# EAGLE schematic StarvingStudent (EAGLE 7.5.0)
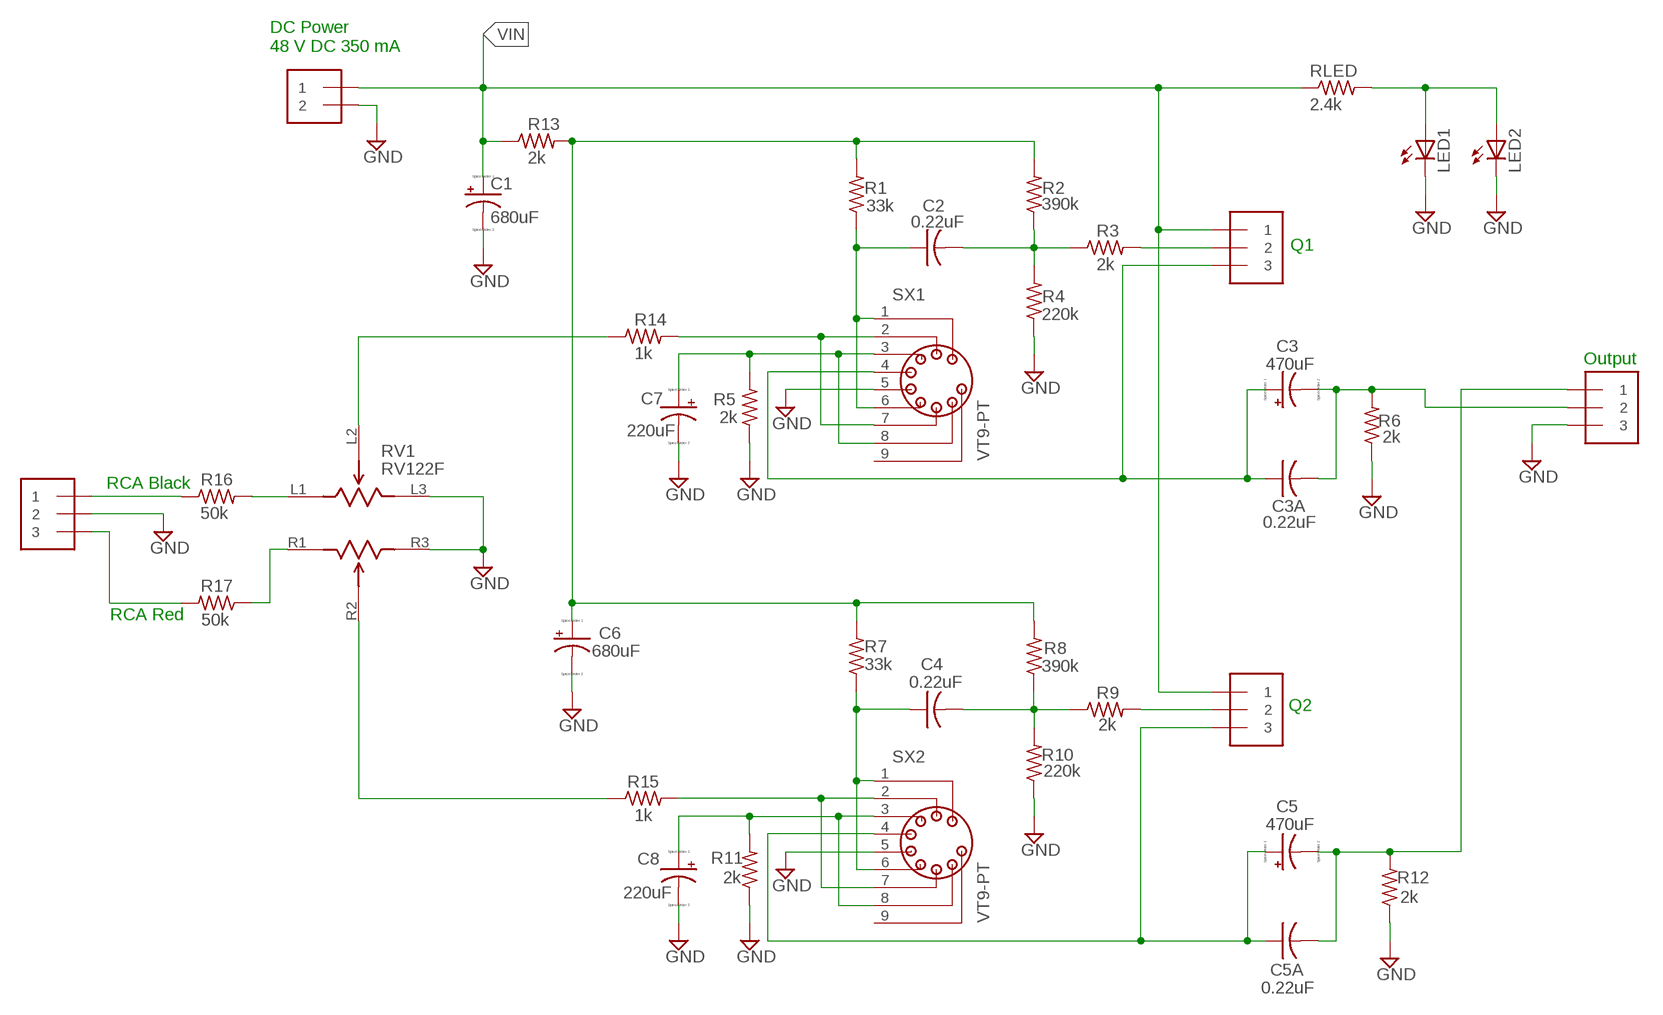
[diagram p0: schematic, sheet 1]

## Parts
C1  680uF  CPOL-USE7.5-18  [E7,5-18]
C2  0.22uF  C-US150-072X183  [C150-072X183]
C3  470uF  CPOL-USE5-13  [E5-13]
C3A  0.22uF  C-US150-072X183  [C150-072X183]
C4  0.22uF  C-US150-072X183  [C150-072X183]
C5  470uF  CPOL-USE5-13  [E5-13]
C5A  0.22uF  C-US150-072X183  [C150-072X183]
C6  680uF  CPOL-USE7.5-18  [E7,5-18]
C7  220uF  CPOL-USE5-13  [E5-13]
C8  220uF  CPOL-USE5-13  [E5-13]
J1  1X2-3.5MM  [1X2-3.5MM]
J2  1X3-3.5MM  [1X3-3.5MM]
J3  1X3-3.5MM  [1X3-3.5MM]
J4  1X3-3.5MM  [1X3-3.5MM]
J5  1X3-3.5MM  [1X3-3.5MM]
LED1  LED3MM  [LED3MM]
LED2  LED3MM  [LED3MM]
R1  33k  R-US_0207/10  [0207/10]
R2  390k  R-US_0207/10  [0207/10]
R3  2k  R-US_0207/10  [0207/10]
R4  220k  R-US_0207/10  [0207/10]
R5  2k  R-US_0207/10  [0207/10]
R6  2k  R-US_0207/10  [0207/10]
R7  33k  R-US_0207/10  [0207/10]
R8  390k  R-US_0207/10  [0207/10]
R9  2k  R-US_0207/10  [0207/10]
R10  220k  R-US_0207/10  [0207/10]
R11  2k  R-US_0207/10  [0207/10]
R12  2k  R-US_0207/10  [0207/10]
R13  2k  R-US_0207/10  [0207/10]
R14  1k  R-US_0207/10  [0207/10]
R15  1k  R-US_0207/10  [0207/10]
R16  50k  R-US_0207/10  [0207/10]
R17  50k  R-US_0207/10  [0207/10]
RLED  2.4k  R-US_0411/15  [0411/15]
RV1  RV122F  [RV122F]
SX1  VT9-PT  [VT9-PT]
SX2  VT9-PT  [VT9-PT]

## Nets
GND: C1.- C6.- C7.- C8.- J1.2 J2.2 J5.1 LED1.K(C) LED2.K(C) R4.1 R5.1 R6.1 R10.1 R11.1 R12.1 RV1.L3 RV1.R3 SX1.5 SX2.5
N$1: J2.3 R16.1
N$2: J2.1 R17.2
N$3: C2.1 R1.1 SX1.1 SX1.6
N$4: C7.+ R5.2 SX1.3 SX1.8
N$5: R14.2 SX1.2 SX1.7
N$6: LED1.A LED2.A RLED.2
N$7: C2.2 R2.1 R3.1 R4.2
N$8: C5.+ C5A.1 J4.1 SX2.4
N$9: J3.2 R3.2
N$10: C6.+ R1.2 R2.2 R7.2 R8.2 R13.2
N$11: C4.1 R7.1 SX2.1 SX2.6
N$12: C8.+ R11.2 SX2.3 SX2.8
N$13: R15.2 SX2.2 SX2.7
N$14: R14.1 RV1.L2
N$15: C4.2 R8.1 R9.1 R10.2
N$16: J4.2 R9.2
N$17: C3.+ C3A.1 J3.1 SX1.4
N$18: C5.- C5A.2 J5.3 R12.2
N$19: R15.1 RV1.R2
N$20: C3.- C3A.2 J5.2 R6.2
N$21: R16.2 RV1.L1
N$22: R17.1 RV1.R1
VIN: C1.+ J1.1 J3.3 J4.3 R13.1 RLED.1
Unconnected: SX1.9 SX2.9

## Notes on the sheet
- DC Power
  48 V DC 350 mA
- Q1
- Output
- RCA Black
- RCA Red
- Q2

## Library data of the parts
C1 C3 C5-C8 = resistor:CPOL-US: POLARIZED CAPACITOR, American symbol
C2 C3A C4 C5A = resistor:C-US: CAPACITOR, American symbol
J1 = DansLibrary:1X2: 2 Position 3.5mm Terminal block Mouser FCL connect datasheet <http://www.mouser.com/ds/2/154/20020327-20111.pdf>
J2-J5 = DansLibrary:1X3: 3 Position 3.5mm Terminal block Mouser FCL connect datasheet <http://www.mouser.com/ds/2/154/20020327-20111.pdf>
LED1 LED2 = adafruit:LED: LED OSRAM: - CHIPLED LG R971, LG N971, LY N971, LG Q971, LY Q971, LO R971, LY R971 LH N974, LH R974 LS Q976, LO Q976, LY Q976 LO Q996 - Hyper CHIPLED LW Q18S LB Q993, LB Q99A, LB R99A - SideLED LS A670, LO A670, LY A670, LG A670, LP A670 LB A673, LV A673, LT A673, LW A673 LH A674 LY A675 LS A676, LA A676, LO A676, LY A676, LW A676 LS A679, LY A679, LG A679 - Hyper Micro SIDELED® LS Y876, LA Y876, LO Y876, LY Y876 LT Y87S - SmartLED LW L88C, LW L88S LB L89C, LB L89S, LG L890 LS L89K, LO L89K, LY L89K LS L896, LA L896, LO L896, LY L896 - TOPLED LS T670, LO T670, LY T670, LG T670, LP T670 LSG T670, LSP T670, LSY T670, LOP T670, LYG T670 LG T671, LOG T671, LSG T671 LB T673, LV T673, LT T673, LW T673 LH T674 LS T676, LA T676, LO T676, LY T676, LB T676, LH T676, LSB T676, LW T676 LB T67C, LV T67C, LT T67C, LS T67K, LO T67K, LY T67K, LW E67C LS E67B, LA E67B, LO E67B, LY E67B, LB E67C, LV E67C, LT E67C LW T67C LS T679, LY T679, LG T679 LS T770, LO T770, LY T770, LG T770, LP T770 LB T773, LV T773, LT T773, LW T773 LH T774 LS E675, LA E675, LY E675, LS T675 LS T776, LA T776, LO T776, LY T776, LB T776 LHGB T686 LT T68C, LB T68C - Hyper Mini TOPLED® LB M676 - Mini TOPLED Santana® LG M470 LS M47K, LO M47K, LY M47K Source: http://www.osram.convergy.de/
R1-R17 RLED = adafruit:R-US_: RESISTOR, American symbol
RV1 = DansLibrary:RV122F
SX1 SX2 = belton-engineering:VT9: VACUUM TUBE SOCKET Source: 00004280-VT9-PT.pdf